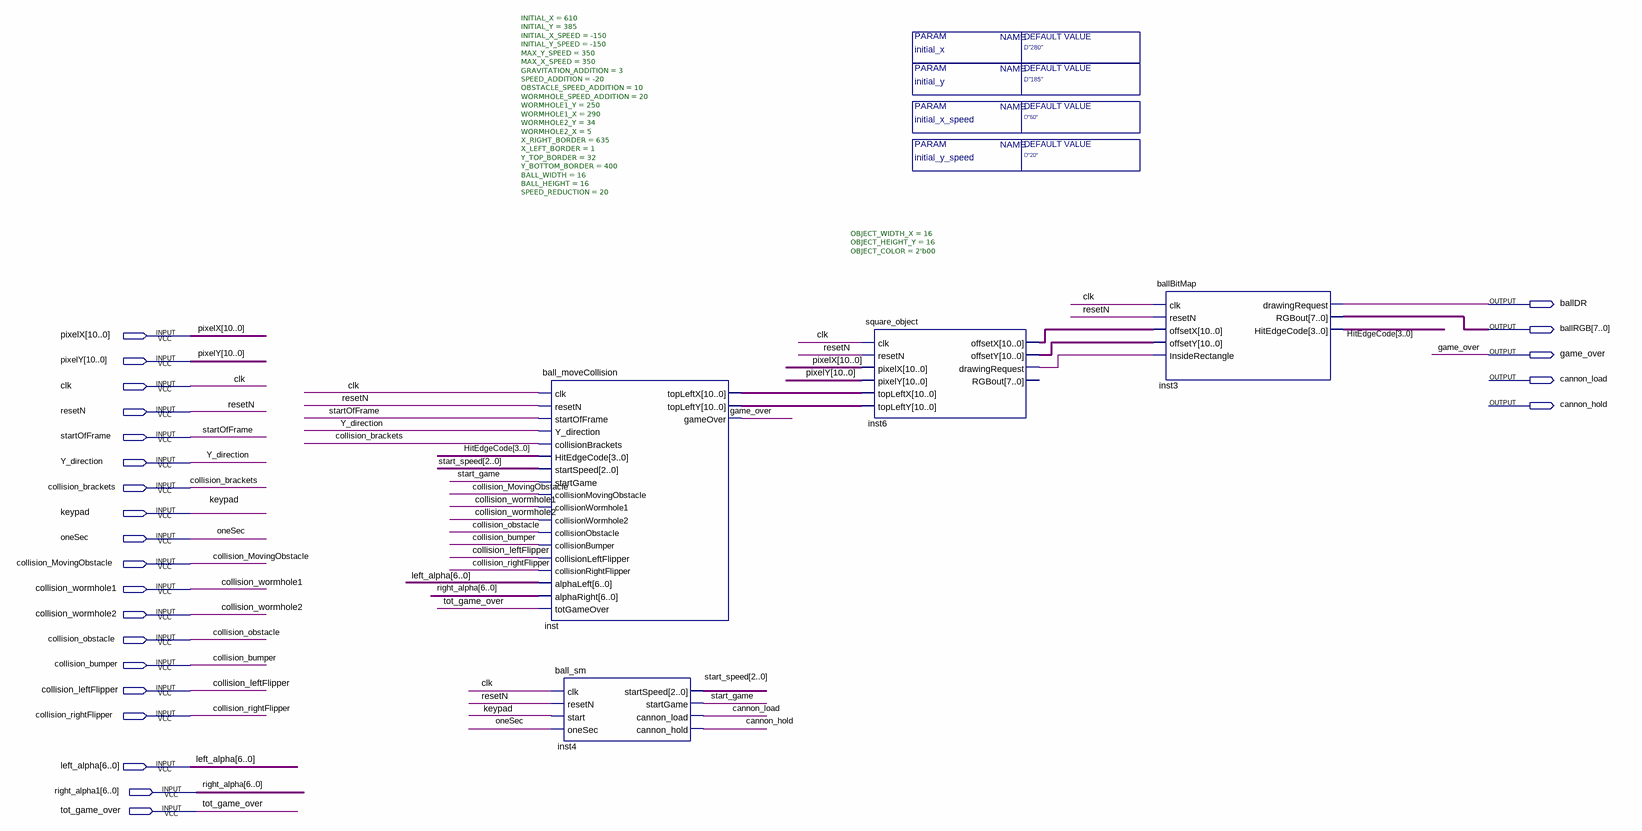
[diagram p0: schematic sheet]
// Quartus schematic ball_Block.bdf as structural Verilog: 4 symbols, 24 pins
module ball_Block #(parameter initial_x = "D\"280\"", parameter initial_y = "D\"185\"", parameter initial_x_speed = "D\"60\"", parameter initial_y_speed = "D\"20\"") (
  input  [10:0] pixelX,
  input  [10:0] pixelY,
  input  clk,
  input  resetN,
  input  startOfFrame,
  input  Y_direction,
  input  collision_brackets,
  input  keypad,
  input  oneSec,
  input  collision_MovingObstacle,
  input  collision_wormhole1,
  input  collision_wormhole2,
  input  collision_obstacle,
  input  collision_bumper,
  input  collision_leftFlipper,
  input  collision_rightFlipper,
  input  [6:0] left_alpha,
  input  [6:0] right_alpha1,
  input  tot_game_over,
  output ballDR,
  output [7:0] ballRGB,
  output game_over,
  output cannon_load,
  output cannon_hold
);

  wire inst6_drawingrequest, start_game;
  wire [2:0] start_speed;
  wire [3:0] HitEdgeCode;
  wire [10:0] inst6_offsetx, inst6_offsety, inst_topleftx, inst_toplefty;

  ball_moveCollision #(.INITIAL_X(610), .INITIAL_Y(385), .INITIAL_X_SPEED(-150), .INITIAL_Y_SPEED(-150), .MAX_Y_SPEED(350), .MAX_X_SPEED(350), .GRAVITATION_ADDITION(3), .SPEED_ADDITION(-20), .OBSTACLE_SPEED_ADDITION(10), .WORMHOLE_SPEED_ADDITION(20), .WORMHOLE1_Y(250), .WORMHOLE1_X(290), .WORMHOLE2_Y(34), .WORMHOLE2_X(5), .X_RIGHT_BORDER(635), .X_LEFT_BORDER(1), .Y_TOP_BORDER(32), .Y_BOTTOM_BORDER(400), .BALL_WIDTH(16), .BALL_HEIGHT(16), .SPEED_REDUCTION(20)) inst (
    .clk(clk), .resetN(resetN), .startOfFrame(startOfFrame), .Y_direction(Y_direction),
    .collisionBrackets(collision_brackets), .HitEdgeCode(HitEdgeCode), .startSpeed(start_speed),
    .startGame(start_game), .collisionMovingObstacle(collision_MovingObstacle),
    .collisionWormhole1(collision_wormhole1), .collisionWormhole2(collision_wormhole2),
    .collisionObstacle(collision_obstacle), .collisionBumper(collision_bumper),
    .collisionLeftFlipper(collision_leftFlipper), .collisionRightFlipper(collision_rightFlipper),
    .alphaLeft(left_alpha), .alphaRight(right_alpha1), .totGameOver(tot_game_over), .topLeftX(inst_topleftx),
    .topLeftY(inst_toplefty), .gameOver(game_over));
  ball_sm inst4 (
    .clk(clk), .resetN(resetN), .start(keypad), .oneSec(oneSec), .startSpeed(start_speed),
    .startGame(start_game), .cannon_load(cannon_load), .cannon_hold(cannon_hold));
  square_object #(.OBJECT_WIDTH_X(16), .OBJECT_HEIGHT_Y(16), .OBJECT_COLOR(2'b00)) inst6 (
    .clk(clk), .resetN(resetN), .pixelX(pixelX), .pixelY(pixelY), .topLeftX(inst_topleftx),
    .topLeftY(inst_toplefty), .offsetX(inst6_offsetx), .offsetY(inst6_offsety),
    .drawingRequest(inst6_drawingrequest));  // open: RGBout
  ballBitMap inst3 (
    .clk(clk), .resetN(resetN), .offsetX(inst6_offsetx), .offsetY(inst6_offsety),
    .InsideRectangle(inst6_drawingrequest), .drawingRequest(ballDR), .RGBout(ballRGB),
    .HitEdgeCode(HitEdgeCode));

  // Other names for the same wires on the sheet: right_alpha[6:0] = right_alpha1
endmodule
